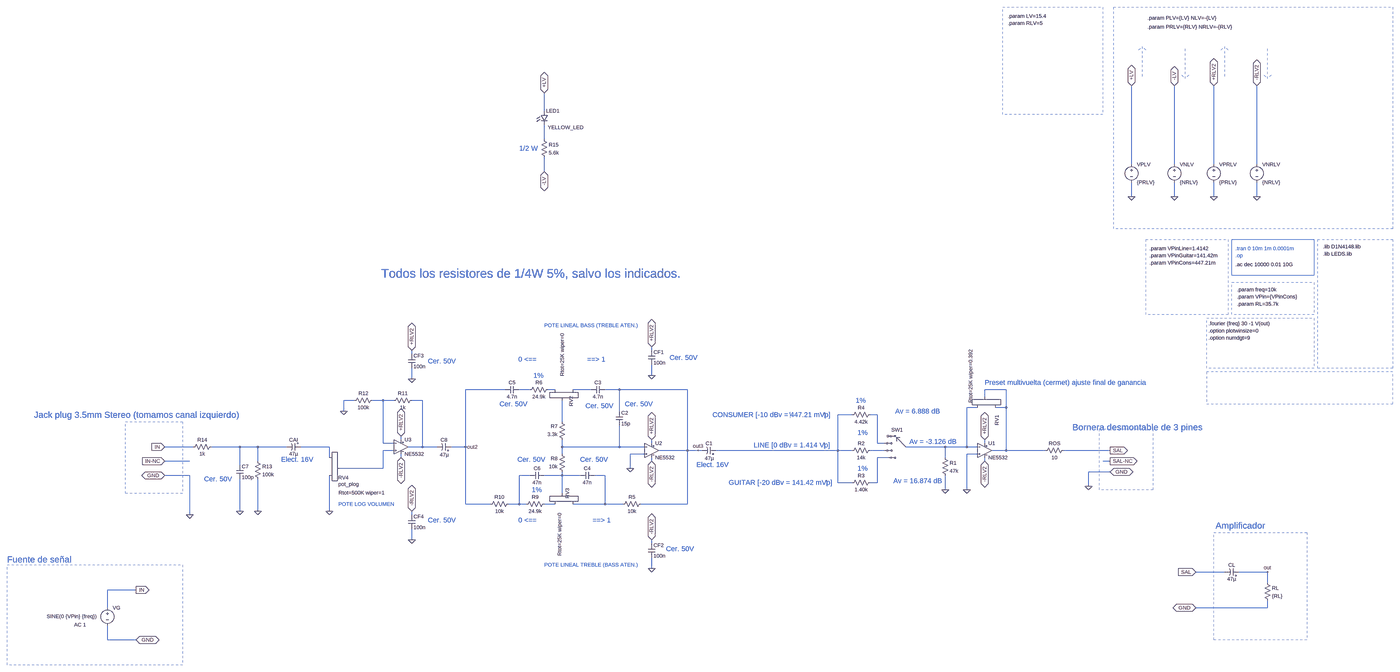
[diagram p0: schematic preamp_V2.0.asc, whole sheet]
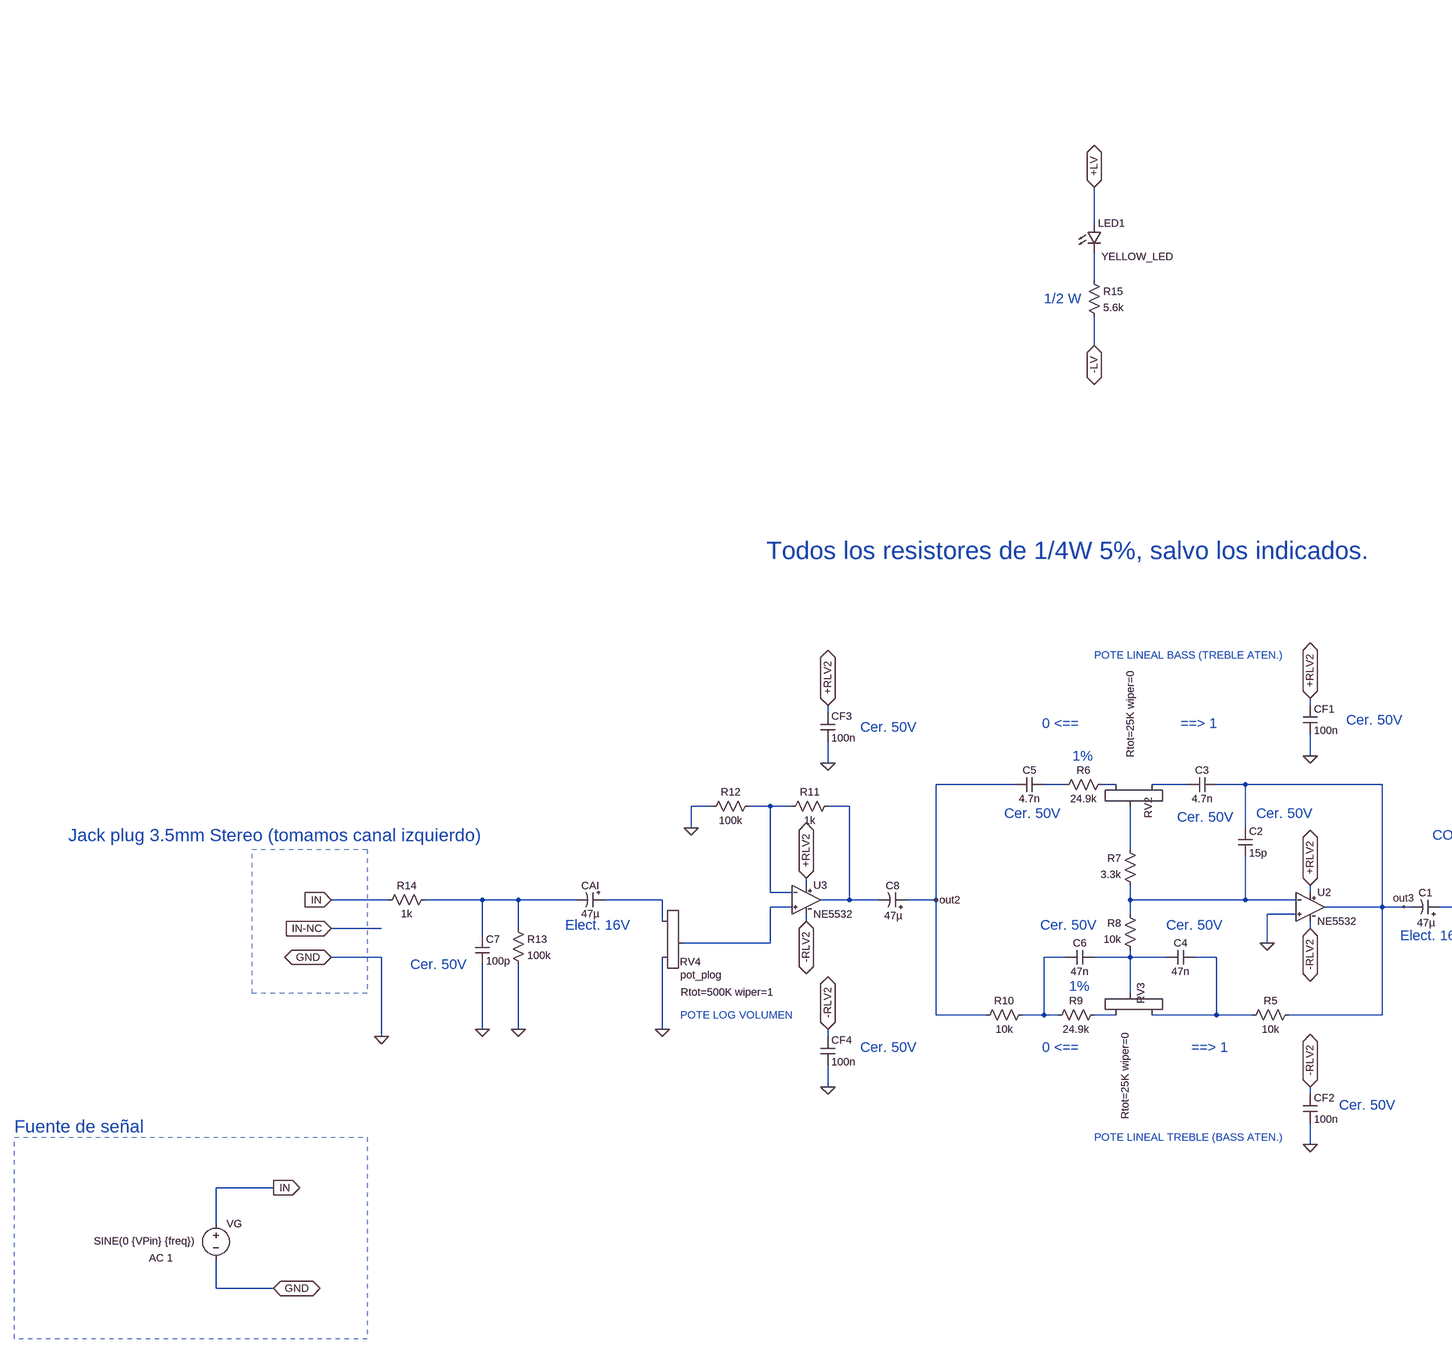
[diagram p1: schematic preamp_V2.0.asc, part, row 1 of 1, column 1 of 2]
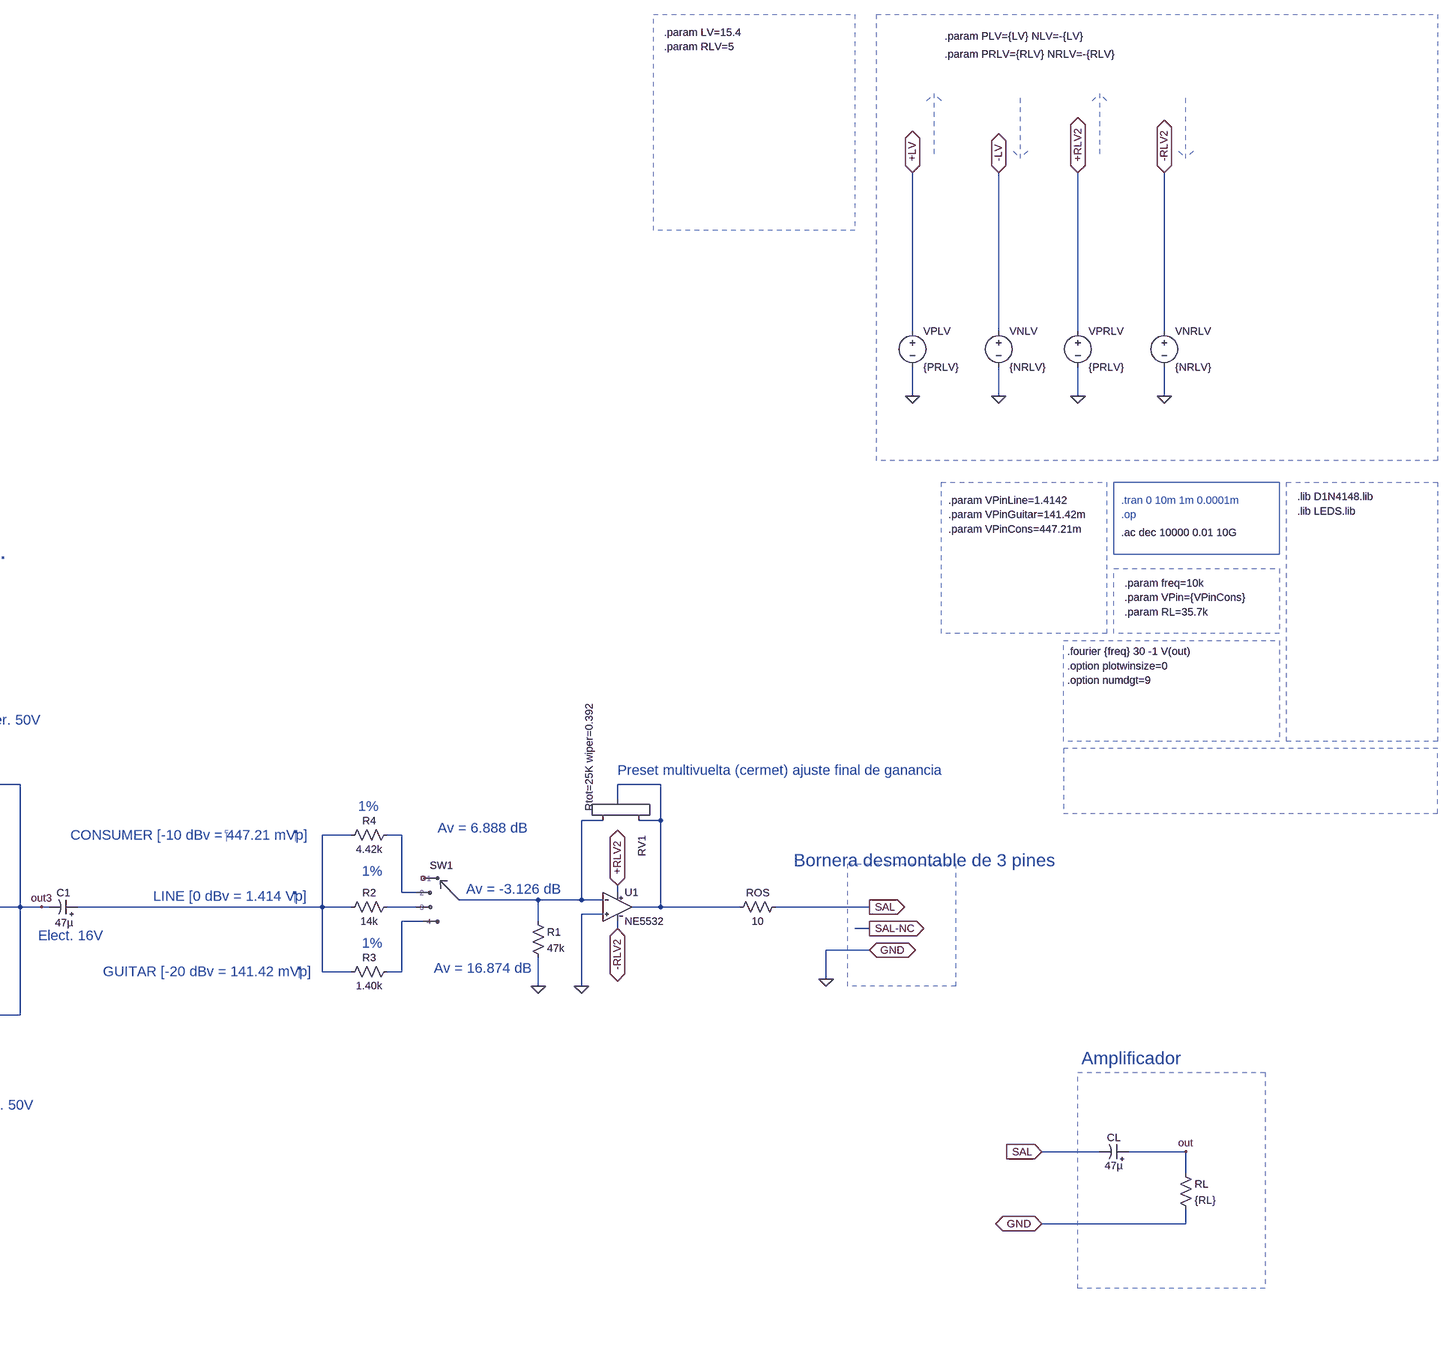
[diagram p2: schematic preamp_V2.0.asc, part, row 1 of 1, column 2 of 2]
preamp_V2.0.asc, the LTspice schematic file:
Version 4
SHEET 1 4212 2620
WIRE -832 -1584 -832 -1664
WIRE -832 -1456 -832 -1520
WIRE 1792 -1344 1792 -1696
WIRE 1984 -1344 1984 -1696
WIRE 2160 -1344 2160 -1696
WIRE 2352 -1344 2352 -1696
WIRE -832 -1312 -832 -1376
WIRE 1792 -1200 1792 -1264
WIRE 1984 -1200 1984 -1264
WIRE 2160 -1200 2160 -1264
WIRE 2352 -1200 2352 -1264
WIRE -352 -512 -352 -528
WIRE -1424 -496 -1424 -512
WIRE -352 -400 -352 -448
WIRE -1424 -384 -1424 -432
WIRE -1008 -336 -1184 -336
WIRE -896 -336 -944 -336
WIRE -784 -336 -816 -336
WIRE -624 -336 -704 -336
WIRE -496 -336 -560 -336
WIRE -192 -336 -496 -336
WIRE 1232 -336 1136 -336
WIRE 1136 -304 1136 -336
WIRE -1680 -288 -1728 -288
WIRE -1552 -288 -1600 -288
WIRE -1504 -288 -1552 -288
WIRE -1376 -288 -1424 -288
WIRE 1104 -256 1056 -256
WIRE 1232 -256 1232 -336
WIRE 1232 -256 1184 -256
WIRE -1728 -240 -1728 -288
WIRE -496 -240 -496 -336
WIRE 544 -224 480 -224
WIRE 656 -224 624 -224
WIRE -752 -192 -752 -288
WIRE -1472 -112 -1472 -128
WIRE -1552 -96 -1552 -288
WIRE -1504 -96 -1552 -96
WIRE -352 -96 -352 -112
WIRE 656 -96 656 -224
WIRE 688 -96 656 -96
WIRE 1136 -96 1136 -112
WIRE -2400 -80 -2528 -80
WIRE -2192 -80 -2320 -80
WIRE -2112 -80 -2192 -80
WIRE -1984 -80 -2112 -80
WIRE -1792 -80 -1920 -80
WIRE -1376 -80 -1376 -288
WIRE -1376 -80 -1440 -80
WIRE -1312 -80 -1376 -80
WIRE -1184 -80 -1184 -336
WIRE -1184 -80 -1248 -80
WIRE -752 -80 -752 -112
WIRE -496 -80 -496 -176
WIRE -496 -80 -752 -80
WIRE -384 -80 -496 -80
WIRE 960 -80 784 -80
WIRE 1056 -80 1056 -256
WIRE 1056 -80 960 -80
WIRE 1104 -80 1056 -80
WIRE -1504 -64 -1552 -64
WIRE -192 -64 -192 -336
WIRE -192 -64 -320 -64
WIRE -144 -64 -192 -64
WIRE -128 -64 -144 -64
WIRE 480 -64 480 -224
WIRE 480 -64 -64 -64
WIRE 544 -64 480 -64
WIRE 688 -64 624 -64
WIRE 1232 -64 1232 -256
WIRE 1232 -64 1168 -64
WIRE 1408 -64 1232 -64
WIRE 1696 -64 1488 -64
WIRE -752 -48 -752 -80
WIRE -384 -48 -448 -48
WIRE 1104 -48 1056 -48
WIRE -1792 -32 -1792 -80
WIRE -1472 -32 -1472 -48
WIRE 704 -32 656 -32
WIRE 960 -32 960 -80
WIRE -2416 -16 -2528 -16
WIRE -2112 -16 -2112 -80
WIRE -352 -16 -352 -32
WIRE 1136 -16 1136 -32
WIRE 1696 -16 1664 -16
WIRE -2192 0 -2192 -80
WIRE -1552 16 -1552 -64
WIRE -1552 16 -1744 16
WIRE -448 16 -448 -48
WIRE 1696 32 1600 32
WIRE -2416 48 -2528 48
WIRE -896 48 -944 48
WIRE -752 48 -752 32
WIRE -752 48 -832 48
WIRE -672 48 -752 48
WIRE -560 48 -608 48
WIRE 480 80 480 -64
WIRE 544 80 480 80
WIRE 656 80 656 -32
WIRE 656 80 624 80
WIRE 1600 96 1600 32
WIRE 960 112 960 48
WIRE 1056 112 1056 -48
WIRE -752 128 -752 48
WIRE -1184 176 -1184 -80
WIRE -1072 176 -1184 176
WIRE -944 176 -944 48
WIRE -944 176 -992 176
WIRE -912 176 -944 176
WIRE -784 176 -832 176
WIRE -560 176 -560 48
WIRE -560 176 -704 176
WIRE -480 176 -560 176
WIRE -192 176 -192 -64
WIRE -192 176 -400 176
WIRE -2192 208 -2192 64
WIRE -2112 208 -2112 64
WIRE -1792 208 -1792 48
WIRE -2416 224 -2416 48
WIRE -1424 224 -1424 208
WIRE -1424 336 -1424 288
WIRE -352 352 -352 336
WIRE -352 464 -352 416
WIRE 2208 480 2080 480
WIRE 2400 480 2272 480
WIRE 2400 528 2400 480
WIRE -2656 560 -2784 560
WIRE -2784 640 -2784 560
WIRE 2400 640 2400 608
WIRE 2400 640 2080 640
WIRE -2784 784 -2784 720
WIRE -2656 784 -2784 784
FLAG 2160 -1200 0
FLAG 2160 -1696 +RLV2
IOPIN 2160 -1696 BiDir
FLAG 2352 -1200 0
FLAG 2352 -1696 -RLV2
IOPIN 2352 -1696 BiDir
FLAG 1056 112 0
FLAG 1136 -16 -RLV2
IOPIN 1136 -16 BiDir
FLAG 1136 -112 +RLV2
IOPIN 1136 -112 BiDir
FLAG 2400 480 out
FLAG -2112 208 0
FLAG -2192 208 0
FLAG -1792 208 0
FLAG -1472 -32 -RLV2
IOPIN -1472 -32 BiDir
FLAG -1472 -128 +RLV2
IOPIN -1472 -128 BiDir
FLAG -352 -16 -RLV2
IOPIN -352 -16 BiDir
FLAG -352 -112 +RLV2
IOPIN -352 -112 BiDir
FLAG -448 16 0
FLAG -1184 -80 out2
FLAG -144 -64 out3
FLAG -1424 -384 0
FLAG -1424 -512 +RLV2
IOPIN -1424 -512 BiDir
FLAG -1424 336 0
FLAG -1424 208 -RLV2
IOPIN -1424 208 BiDir
FLAG -352 -400 0
FLAG -352 -528 +RLV2
IOPIN -352 -528 BiDir
FLAG -352 464 0
FLAG -352 336 -RLV2
IOPIN -352 336 BiDir
FLAG 960 112 0
FLAG 1600 96 0
FLAG 1696 -64 SAL
IOPIN 1696 -64 Out
FLAG 1696 32 GND
IOPIN 1696 32 BiDir
FLAG 2080 640 GND
IOPIN 2080 640 BiDir
FLAG 2080 480 SAL
IOPIN 2080 480 In
FLAG -2528 -80 IN
IOPIN -2528 -80 In
FLAG -2528 -16 IN-NC
IOPIN -2528 -16 In
FLAG -2528 48 GND
IOPIN -2528 48 BiDir
FLAG -2416 224 0
FLAG -2656 784 GND
IOPIN -2656 784 BiDir
FLAG -2656 560 IN
IOPIN -2656 560 Out
FLAG 1696 -16 SAL-NC
IOPIN 1696 -16 Out
FLAG -832 -1664 +LV
IOPIN -832 -1664 BiDir
FLAG -832 -1312 -LV
IOPIN -832 -1312 BiDir
FLAG 1792 -1200 0
FLAG 1792 -1696 +LV
IOPIN 1792 -1696 BiDir
FLAG 1984 -1200 0
FLAG 1984 -1696 -LV
IOPIN 1984 -1696 BiDir
FLAG -1728 -240 0
DATAFLAG 2400 -1824 "I(Vnrlv)"
DATAFLAG 2208 -1824 "-I(Vprlv)"
DATAFLAG 1328 -64 ""
DATAFLAG -192 -192 ""
DATAFLAG -1184 -208 ""
DATAFLAG 2032 -1824 "I(Vnlv)"
DATAFLAG 1840 -1824 "-I(Vplv)"
SYMBOL voltage -2784 624 R0
WINDOW 3 -271 55 Left 2
WINDOW 123 -149 92 Left 2
WINDOW 39 0 0 Left 2
SYMATTR Value SINE(0 {VPin} {freq})
SYMATTR Value2 AC 1
SYMATTR InstName VG
SYMBOL polcap -1920 -96 R90
WINDOW 0 0 32 VBottom 2
WINDOW 3 32 32 VTop 2
SYMATTR InstName CAI
SYMATTR Value 47µ
SYMBOL voltage 2160 -1360 R0
SYMATTR InstName VPRLV
SYMATTR Value {PRLV}
SYMBOL voltage 2352 -1360 R0
SYMATTR InstName VNRLV
SYMATTR Value {NRLV}
SYMBOL res 2384 512 R0
SYMATTR InstName RL
SYMATTR Value {RL}
SYMBOL NE5532 1136 -128 R0
SYMATTR InstName U1
SYMBOL potentiometer_standard -1808 -48 R0
WINDOW 0 55 106 Left 2
WINDOW 3 57 173 Left 2
WINDOW 39 51 172 Invisible 2
WINDOW 38 56 135 Left 2
SYMATTR InstName RV4
SYMATTR Value Rtot=500K wiper=1
SYMATTR SpiceModel pot_plog
SYMBOL res -2128 -32 R0
SYMATTR InstName R13
SYMATTR Value 100k
SYMBOL cap -2208 0 R0
SYMATTR InstName C7
SYMATTR Value 100p
SYMBOL NE5532 -1472 -144 R0
SYMATTR InstName U3
SYMBOL NE5532 -352 -128 R0
SYMATTR InstName U2
SYMBOL potentiometer_standard -688 -352 R90
WINDOW 3 -238 63 Left 2
WINDOW 39 -212 100 Invisible 2
WINDOW 38 -131 29 Left 2
WINDOW 0 45 23 Left 2
SYMATTR Value Rtot=25K wiper=0
SYMATTR InstName RV2
SYMBOL cap -512 -240 R0
SYMATTR InstName C2
SYMATTR Value 15p
SYMBOL cap -560 -352 R90
WINDOW 0 0 32 VBottom 2
WINDOW 3 32 32 VTop 2
SYMATTR InstName C3
SYMATTR Value 4.7n
SYMBOL cap -944 -352 R90
WINDOW 0 0 32 VBottom 2
WINDOW 3 32 32 VTop 2
SYMATTR InstName C5
SYMATTR Value 4.7n
SYMBOL cap -832 32 R90
WINDOW 0 0 32 VBottom 2
WINDOW 3 32 32 VTop 2
SYMATTR InstName C6
SYMATTR Value 47n
SYMBOL potentiometer_standard -688 192 M270
WINDOW 3 -216 75 Left 2
WINDOW 39 -209 98 Invisible 2
WINDOW 38 -92 37 Left 2
WINDOW 0 40 40 Left 2
SYMATTR Value Rtot=25K wiper=0
SYMATTR InstName RV3
SYMBOL res -384 160 R90
WINDOW 0 0 56 VBottom 2
WINDOW 3 32 56 VTop 2
SYMATTR InstName R5
SYMATTR Value 10k
SYMBOL res -976 160 R90
WINDOW 0 0 56 VBottom 2
WINDOW 3 32 56 VTop 2
SYMATTR InstName R10
SYMATTR Value 10k
SYMBOL res -736 48 R180
WINDOW 0 36 76 Left 2
WINDOW 3 36 40 Left 2
SYMATTR InstName R8
SYMATTR Value 10k
SYMBOL res -736 -96 R180
WINDOW 0 36 76 Left 2
WINDOW 3 36 40 Left 2
SYMATTR InstName R7
SYMATTR Value 3.3k
SYMBOL res -2304 -96 R90
WINDOW 0 0 56 VBottom 2
WINDOW 3 32 56 VTop 2
SYMATTR InstName R14
SYMATTR Value 1k
SYMBOL res 1504 -80 R90
WINDOW 0 0 56 VBottom 2
WINDOW 3 32 56 VTop 2
SYMATTR InstName ROS
SYMATTR Value 10
SYMBOL polcap 2272 496 M270
WINDOW 0 32 32 VTop 2
WINDOW 3 0 32 VBottom 2
SYMATTR InstName CL
SYMATTR Value 47µ
SYMBOL polcap -64 -48 M270
WINDOW 0 32 32 VTop 2
WINDOW 3 -4 30 VBottom 2
SYMATTR InstName C1
SYMATTR Value 47µ
SYMBOL cap -608 32 R90
WINDOW 0 0 32 VBottom 2
WINDOW 3 32 32 VTop 2
SYMATTR InstName C4
SYMATTR Value 47n
SYMBOL res -816 160 R90
WINDOW 0 0 56 VBottom 2
WINDOW 3 32 56 VTop 2
SYMATTR InstName R9
SYMATTR Value 24.9k
SYMBOL res -800 -352 R90
WINDOW 0 0 56 VBottom 2
WINDOW 3 32 56 VTop 2
SYMATTR InstName R6
SYMATTR Value 24.9k
SYMBOL cap -1440 -496 R0
SYMATTR InstName CF3
SYMATTR Value 100n
SYMBOL cap -1440 224 R0
SYMATTR InstName CF4
SYMATTR Value 100n
SYMBOL cap -368 -512 R0
SYMATTR InstName CF1
SYMATTR Value 100n
SYMBOL cap -368 352 R0
SYMATTR InstName CF2
SYMATTR Value 100n
SYMBOL res 640 -240 R90
WINDOW 0 0 56 VBottom 2
WINDOW 3 32 56 VTop 2
SYMATTR InstName R4
SYMATTR Value 4.42k
SYMBOL res 640 64 R90
WINDOW 0 0 56 VBottom 2
WINDOW 3 32 56 VTop 2
SYMATTR InstName R3
SYMATTR Value 1.40k
SYMBOL res 640 -80 R90
WINDOW 0 0 56 VBottom 2
WINDOW 3 32 56 VTop 2
SYMATTR InstName R2
SYMATTR Value 14k
SYMBOL res 944 -48 R0
SYMATTR InstName R1
SYMATTR Value 47k
SYMBOL potentiometer_standard 1200 -240 M270
WINDOW 3 36 126 Left 2
WINDOW 39 -209 98 Invisible 2
WINDOW 38 36 103 Left 2
WINDOW 0 -64 9 Left 2
SYMATTR Value Rtot=25K wiper=0.392
SYMATTR SpiceLine Rtap=0 tap=0.5
SYMATTR InstName RV1
SYMBOL polcap -1248 -64 M270
WINDOW 0 32 32 VTop 2
WINDOW 3 -4 30 VBottom 2
SYMATTR InstName C8
SYMATTR Value 47µ
SYMBOL LED -848 -1584 R0
WINDOW 3 32 74 Left 2
SYMATTR Value YELLOW_LED
SYMATTR InstName LED1
SYMBOL res -848 -1472 R0
SYMATTR InstName R15
SYMATTR Value 5.6k
SYMBOL voltage 1792 -1360 R0
SYMATTR InstName VPLV
SYMATTR Value {PRLV}
SYMBOL voltage 1984 -1360 R0
SYMATTR InstName VNLV
SYMATTR Value {NRLV}
SYMBOL res -1408 -304 R90
WINDOW 0 0 56 VBottom 2
WINDOW 3 32 56 VTop 2
SYMATTR InstName R11
SYMATTR Value 1k
SYMBOL res -1584 -304 R90
WINDOW 0 0 56 VBottom 2
WINDOW 3 32 56 VTop 2
SYMATTR InstName R12
SYMATTR Value 100k
SYMBOL 1P4T 752 -80 R0
WINDOW 0 -33 -76 Left 2
SYMATTR InstName SW1
SYMATTR Value SET=2
SYMATTR SpiceModel 1P4T
TEXT 2256 -968 Left 2 ;.tran 0 10m 1m 0.0001m
TEXT 2264 -784 Left 2 !.param freq=10k
TEXT 2256 -936 Left 2 ;.op
TEXT 2136 -632 Left 2 !.fourier {freq} 30 -1 V(out)
TEXT 2256 -896 Left 2 !.ac dec 10000 0.01 10G
TEXT 2264 -752 Left 2 !.param VPin={VPinCons}
TEXT 2136 -600 Left 2 !.option plotwinsize=0
TEXT 2136 -568 Left 2 !.option numdgt=9
TEXT 2264 -720 Left 2 !.param RL=35.7k
TEXT 1240 -2008 Left 2 !.param LV=15.4
TEXT 1864 -2000 Left 2 !.param PLV={LV} NLV=-{LV}
TEXT 1872 -968 Left 2 !.param VPinLine=1.4142
TEXT 2648 -976 Left 2 !.lib D1N4148.lib
TEXT 2168 272 Left 4 ;Amplificador
TEXT -640 -472 Left 3 ;==> 1
TEXT -864 -472 Right 3 ;0 <==
TEXT -616 248 Left 3 ;==> 1
TEXT -864 248 Right 3 ;0 <==
TEXT -832 -624 Left 2 ;POTE LINEAL BASS (TREBLE ATEN.)
TEXT -832 448 Left 2 ;POTE LINEAL TREBLE (BASS ATEN.)
TEXT 104 -88 Left 3 ;LINE [0 dBv = 1.414 V‬p]
TEXT -8 80 Left 3 ;GUITAR [-20 dBv = 141.42 mV‬p]
TEXT -80 -224 Left 3 ;CONSUMER [-10 dBv = ‭447.21 mV‬p]
TEXT 560 -288 Left 3 ;1%
TEXT 568 -144 Left 3 ;1%
TEXT 568 16 Left 3 ;1%
TEXT 1136 -368 Left 3 ;Preset multivuelta (cermet) ajuste final de ganancia
TEXT -1752 176 Left 2 ;POTE LOG VOLUMEN
TEXT 800 -104 Left 3 ;Av = -3.126 dB
TEXT 728 72 Left 3 ;Av = 16.874 dB
TEXT 736 -240 Left 3 ;Av = 6.888 dB
TEXT -2008 -24 Left 3 ;Elect. 16V
TEXT -152 0 Left 3 ;Elect. 16V
TEXT -2352 64 Left 3 ;Cer. 50V
TEXT -1352 248 Left 3 ;Cer. 50V
TEXT -1352 -464 Left 3 ;Cer. 50V
TEXT -272 -480 Left 3 ;Cer. 50V
TEXT -288 376 Left 3 ;Cer. 50V
TEXT -1032 -272 Left 3 ;Cer. 50V
TEXT -648 -264 Left 3 ;Cer. 50V
TEXT -472 -272 Left 3 ;Cer. 50V
TEXT -672 -24 Left 3 ;Cer. 50V
TEXT -952 -24 Left 3 ;Cer. 50V
TEXT -880 -400 Left 3 ;1%
TEXT -888 112 Left 3 ;1%
TEXT 1872 -936 Left 2 !.param VPinGuitar=141.42m
TEXT 1872 -904 Left 2 !.param VPinCons=447.21m
TEXT -1560 -856 Left 5 ;Todos los resistores de 1/4W 5%, salvo los indicados.
TEXT -3112 -224 Left 4 ;Jack plug 3.5mm Stereo (tomamos canal izquierdo)
TEXT 1528 -168 Left 4 ;Bornera desmontable de 3 pines
TEXT -3232 424 Left 4 ;Fuente de señal
TEXT 1240 -1976 Left 2 !.param RLV=5
TEXT 1864 -1960 Left 2 !.param PRLV={RLV} NRLV=-{RLV}
TEXT 2648 -944 Left 2 !.lib LEDS.lib
TEXT -944 -1416 Left 3 ;1/2 W
LINE Normal 2400 -1728 2400 -1872 2
LINE Normal 2400 -1728 2400 -1728 2
LINE Normal 2400 -1728 2400 -1728 2
LINE Normal 2384 -1744 2400 -1728 2
LINE Normal 2384 -1744 2384 -1744 2
LINE Normal 2416 -1744 2400 -1728 2
LINE Normal 2208 -1872 2208 -1728 2
LINE Normal 2208 -1872 2208 -1872 2
LINE Normal 2208 -1872 2208 -1872 2
LINE Normal 2224 -1856 2208 -1872 2
LINE Normal 2224 -1856 2224 -1856 2
LINE Normal 2192 -1856 2208 -1872 2
LINE Normal 2032 -1728 2032 -1872 2
LINE Normal 2032 -1728 2032 -1728 2
LINE Normal 2032 -1728 2032 -1728 2
LINE Normal 2016 -1744 2032 -1728 2
LINE Normal 2016 -1744 2016 -1744 2
LINE Normal 2048 -1744 2032 -1728 2
LINE Normal 1840 -1872 1840 -1728 2
LINE Normal 1840 -1872 1840 -1872 2
LINE Normal 1840 -1872 1840 -1872 2
LINE Normal 1856 -1856 1840 -1872 2
LINE Normal 1856 -1856 1856 -1856 2
LINE Normal 1824 -1856 1840 -1872 2
RECTANGLE Normal 2608 -848 2240 -1008
RECTANGLE Normal 2608 -672 2240 -816 3
RECTANGLE Normal 2960 -432 2624 -1008 2
RECTANGLE Normal 2608 -432 2128 -656 3
RECTANGLE Normal 2128 -272 2960 -416 3
RECTANGLE Normal 2960 -1056 1712 -2048 4
RECTANGLE Normal 1664 -1568 1216 -2048 2
RECTANGLE Normal 2224 -672 1856 -1008 3
RECTANGLE Normal 2576 784 2160 304 2
RECTANGLE Normal -2448 128 -2704 -192 2
RECTANGLE Normal -2448 896 -3232 448 2
RECTANGLE Normal 1888 112 1648 -160 2

The netlist it stands for:
* preamp_V2.0.asc
VG IN 0 SINE(0 {VPin} {freq}) AC 1
CAI N013 N012 47µ
VPRLV +RLV2 0 {PRLV}
VNRLV -RLV2 0 {NRLV}
RL out 0 {RL}
XU1 0 N008 +RLV2 -RLV2 N005 NE5532 NE5532  ; pins In+ In- V+ V- OUT
XRV4 N013 0 N015 pot_plog Rtot=500K wiper=1
R13 N012 0 100k
C7 N012 0 100p
XU3 N015 N006 +RLV2 -RLV2 N007 NE5532 NE5532  ; pins In+ In- V+ V- OUT
XU2 0 N014 +RLV2 -RLV2 out3 NE5532 NE5532  ; pins In+ In- V+ V- OUT
XRV2 N004 N003 N011 Rtot=25K wiper=0
C2 out3 N014 15p
C3 out3 N004 4.7n
C5 N002 out2 4.7n
C6 N019 N018 47n
XRV3 N020 N021 N019 Rtot=25K wiper=0
R5 out3 N020 10k
R10 N018 out2 10k
R8 N019 N014 10k
R7 N014 N011 3.3k
R14 N012 IN 1k
ROS SAL N005 10
CL out SAL 47µ
C1 N009 out3 47µ
C4 N020 N019 47n
R9 N021 N018 24.9k
R6 N003 N002 24.9k
CF3 +RLV2 0 100n
CF4 -RLV2 0 100n
CF1 +RLV2 0 100n
CF2 -RLV2 0 100n
R4 N010 N009 4.42k
R3 N017 N009 1.40k
R2 N016 N009 14k
R1 N008 0 47k
XRV1 N005 N008 N005 Rtot=25K wiper=0.392 Rtap=0 tap=0.5
C8 out2 N007 47µ
D§LED1 +LV N001 YELLOW_LED
R15 N001 -LV 5.6k
VPLV +LV 0 {PRLV}
VNLV -LV 0 {NRLV}
R11 N007 N006 1k
R12 N006 0 100k
XSW1 N008 NC_01 N010 N016 N017 1P4T SET=2  ; pins C 1 2 3 4
.model D D
.lib standard.dio
* .tran 0 10m 1m 0.0001m
.param freq=10k
* .op
.fourier {freq} 30 -1 V(out)
.ac dec 10000 0.01 10G
.param VPin={VPinCons}
.option plotwinsize=0
.option numdgt=9
.param RL=35.7k
.param LV=15.4
.param PLV={LV} NLV=-{LV}
.param VPinLine=1.4142
.lib D1N4148.lib
* Amplificador
* ==> 1
* 0 <==
* ==> 1
* 0 <==
* POTE LINEAL BASS (TREBLE ATEN.)
* POTE LINEAL TREBLE (BASS ATEN.)
* LINE [0 dBv = 1.414 V‬p]
* GUITAR [-20 dBv = 141.42 mV‬p]
* CONSUMER [-10 dBv = ‭447.21 mV‬p]
* 1%
* 1%
* 1%
* Preset multivuelta (cermet) ajuste final de ganancia
* POTE LOG VOLUMEN
* Av = -3.126 dB
* Av = 16.874 dB
* Av = 6.888 dB
* Elect. 16V
* Elect. 16V
* Cer. 50V
* Cer. 50V
* Cer. 50V
* Cer. 50V
* Cer. 50V
* Cer. 50V
* Cer. 50V
* Cer. 50V
* Cer. 50V
* Cer. 50V
* 1%
* 1%
.param VPinGuitar=141.42m
.param VPinCons=447.21m
* Todos los resistores de 1/4W 5%, salvo los indicados.
* Jack plug 3.5mm Stereo (tomamos canal izquierdo)
* Bornera desmontable de 3 pines
* Fuente de señal
.param RLV=5
.param PRLV={RLV} NRLV=-{RLV}
.lib LEDS.lib
* 1/2 W
.lib NE5532.mod
.lib 1P4T.mod
.backanno
.end